# EAGLE design Low Noise Supply (EAGLE 9.6.2)
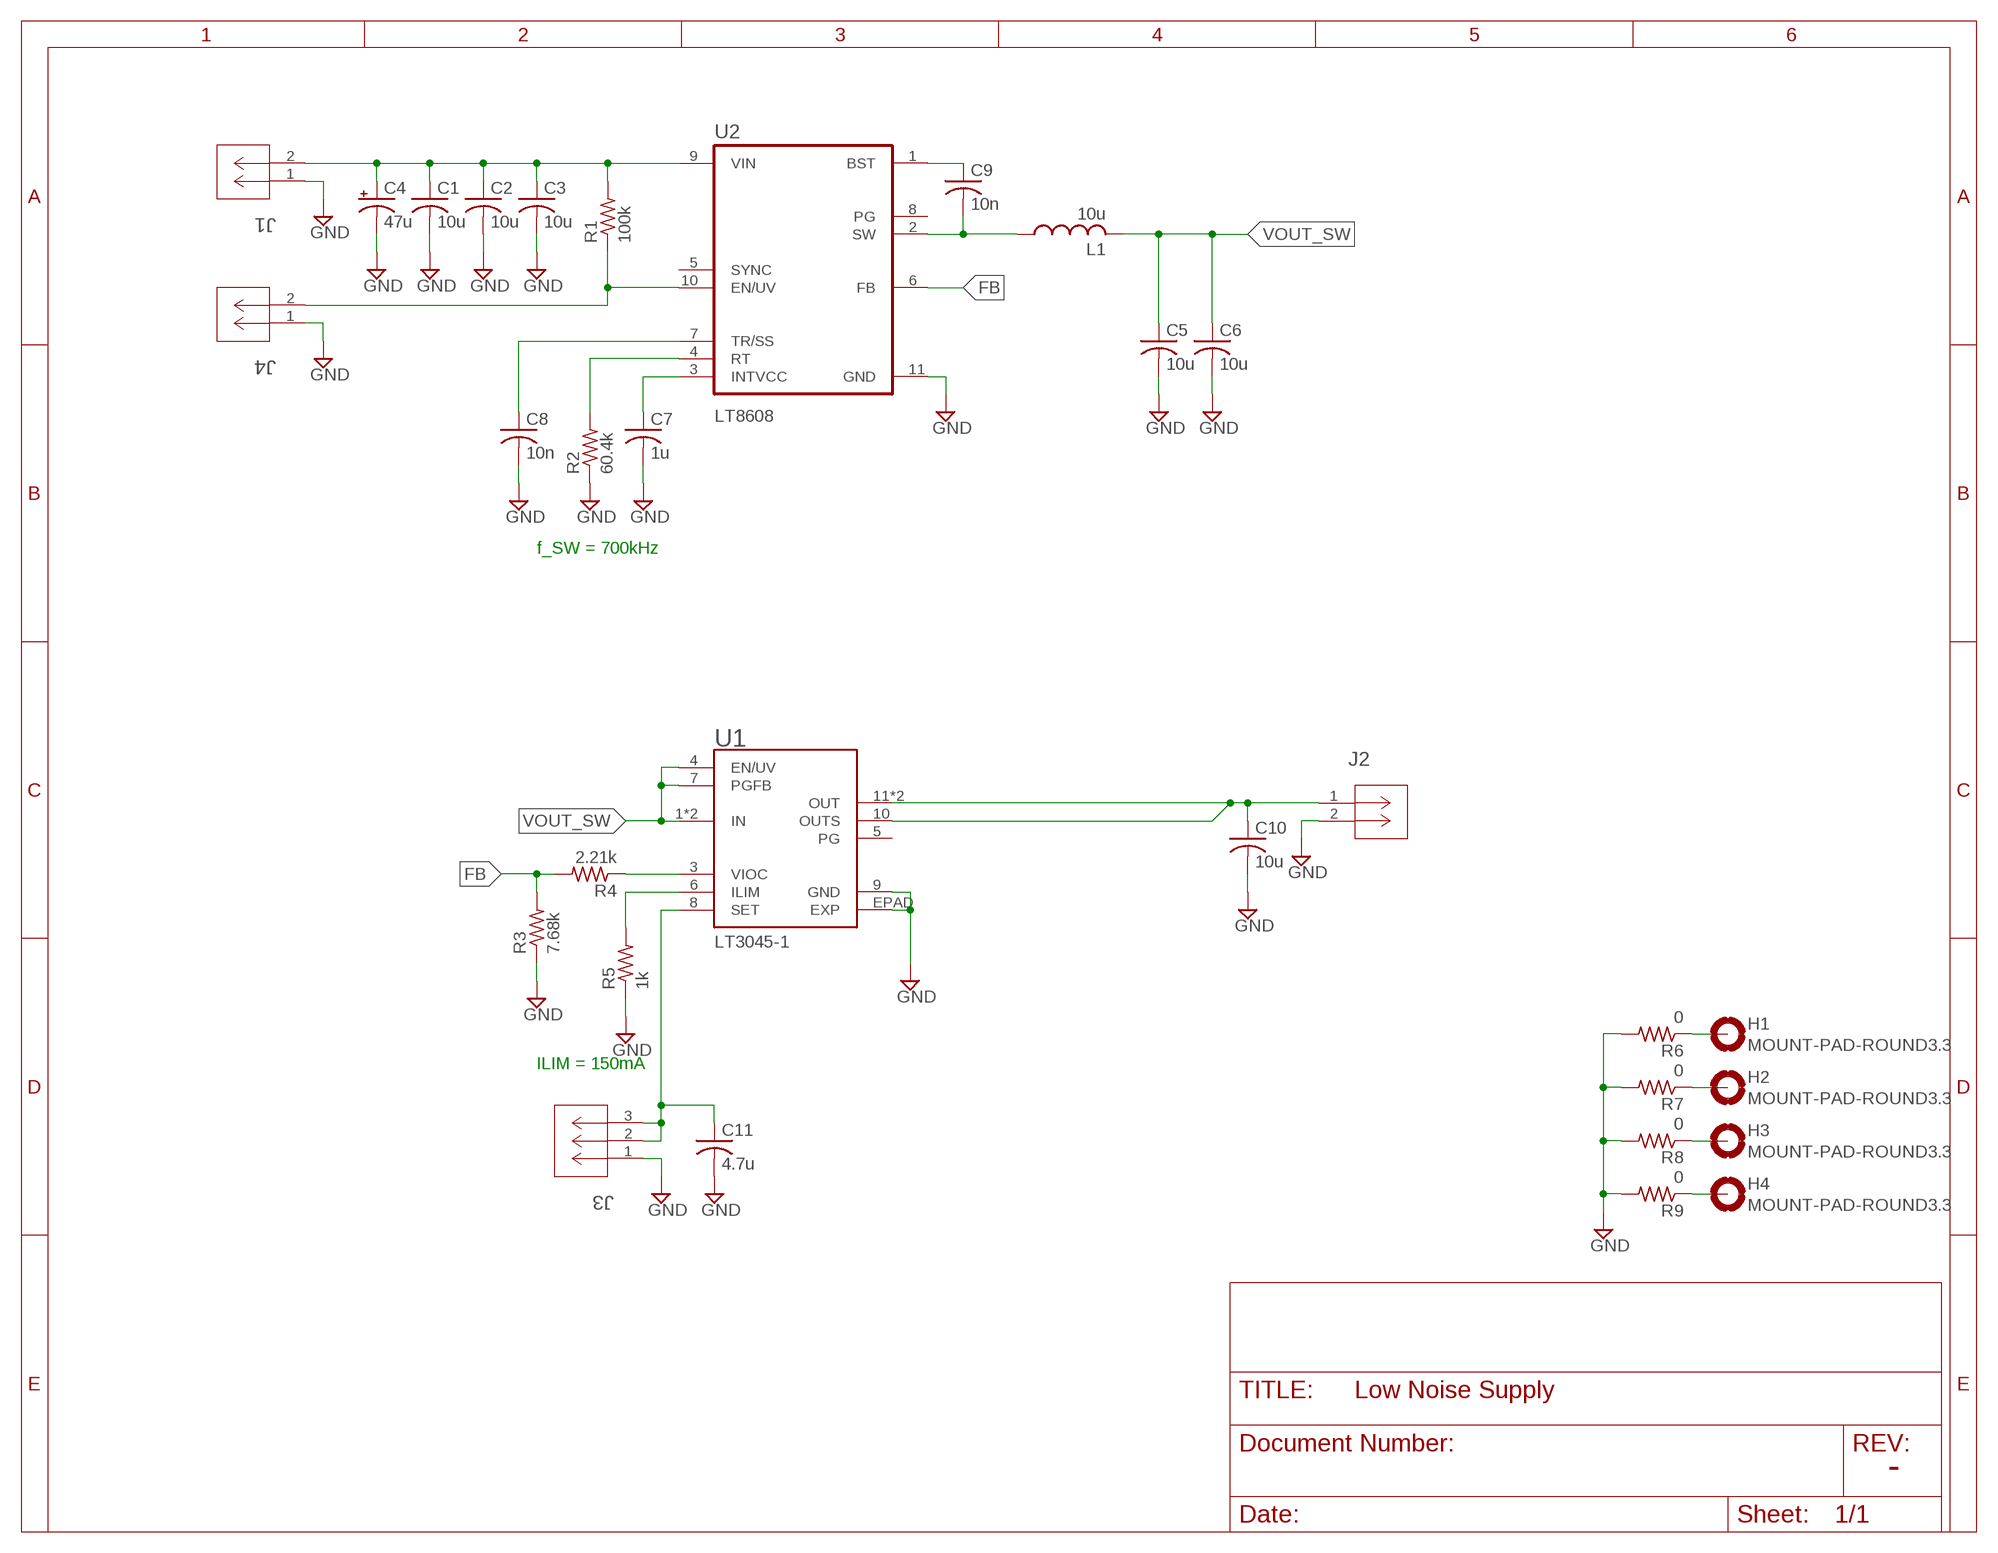
[diagram p0: schematic, sheet 1]

## Parts
C1  10u  C-USC2220K  [C2220K]
C2  10u  C-USC2220K  [C2220K]
C3  10u  C-USC2220K  [C2220K]
C4  47u  CPOL-USF  [PANASONIC_F]
C5  10u  C-USC2220K  [C2220K]
C6  10u  C-USC2220K  [C2220K]
C7  1u  C-USC0805  [C0805]
C8  10n  C-USC0805  [C0805]
C9  10n  C-USC0805  [C0805]
C10  10u  C-USC2220K  [C2220K]
C11  4.7u  C-USC0805  [C0805]
H1  MOUNT-PAD-ROUND3.3  [3,3-PAD]
H2  MOUNT-PAD-ROUND3.3  [3,3-PAD]
H3  MOUNT-PAD-ROUND3.3  [3,3-PAD]
H4  MOUNT-PAD-ROUND3.3  [3,3-PAD]
J1  OSTVN02A150  [CONN_OSTVN02A150_OST]
J2  OSTVN02A150  [CONN_OSTVN02A150_OST]
J3  OSTVN03A150  [CONN3_OSTVN03A150_OST]
J4  OSTVN02A150  [CONN_OSTVN02A150_OST]
L1  10u  L-USL0805  [R0805]
R1  100k  R-US_R0805  [R0805]
R2  60.4k  R-US_R0805  [R0805]
R3  7.68k  R-US_R0805  [R0805]
R4  2.21k  R-US_R0805  [R0805]
R5  1k  R-US_R0805  [R0805]
R6  0  R-US_R0805  [R0805]
R7  0  R-US_R0805  [R0805]
R8  0  R-US_R0805  [R0805]
R9  0  R-US_R0805  [R0805]
U1  LT3045-1  LT3045EMSEPBFMSOP12_MSE_ADI-M  [MSOP12_MSE_ADI-M]
U2  LT8608  LT8608EMSE#PBF  [MSOP-10_MSE]

## Nets
FB: R3.2 R4.2 U2.6(FB)
GND: C1.2 C2.2 C3.2 C4.- C5.2 C6.2 C7.2 C8.2 C10.2 C11.2 J1.1 J2.2 J3.1 J4.1 R2.1 R3.1 R5.1 R6.2 R7.2 R8.2 R9.2 U1.9(GND) U1.EPAD(EXP) U2.11(GND)
N$1: C1.1 C2.1 C3.1 C4.+ J1.2 R1.2 U2.9(VIN)
N$2: J4.2 R1.1 U2.10(EN/UV)
N$3: C7.1 U2.3(INTVCC)
N$4: C8.1 U2.7(TR/SS)
N$5: R2.2 U2.4(RT)
N$6: C9.2 L1.1 U2.2(SW)
N$7: C9.1 U2.1(BST)
N$10: R4.1 U1.3(VIOC)
N$11: C10.1 J2.1 U1.10(OUTS) U1.11(OUT) U1.12(OUT)
N$12: C11.1 J3.2 J3.3 U1.8(SET)
N$13: R5.2 U1.6(ILIM)
N$14: H1.B3,3(MOUNT) R6.1
N$15: H2.B3,3(MOUNT) R7.1
N$16: H3.B3,3(MOUNT) R8.1
N$17: H4.B3,3(MOUNT) R9.1
VOUT_SW: C5.1 C6.1 L1.2 U1.1(IN) U1.2(IN) U1.4(EN/UV) U1.7(PGFB)
Unconnected: U1.5(PG) U2.5(SYNC) U2.8(PG)

## Notes on the sheet
- f_SW = 700kHz
- ILIM = 150mA
- -

## Library data of the parts
C1-C3 C5-C11 = rcl:C-US: CAPACITOR, American symbol
C4 = rcl:CPOL-US: POLARIZED CAPACITOR, American symbol; PN: EEH-ZC1H470P
H1-H4 = holes:MOUNT-PAD-ROUND: MOUNTING PAD, round
J1 J2 J4 = custom_connectors:OSTVN02A150; COPYRIGHT: Copyright (C) 2022 Ultra Librarian. All rights reserved.; DIGI-KEY_PART_NUMBER_1: ED10561-ND; MANUFACTURER_PART_NUMBER: OSTVN02A150; MFR_NAME: On Shore Technology
J3 = custom_connectors:OSTVN03A150; COPYRIGHT: Copyright (C) 2022 Ultra Librarian. All rights reserved.; DIGI-KEY_PART_NUMBER_1: ED10562-ND; MANUFACTURER_PART_NUMBER: OSTVN03A150; MFR_NAME: On Shore Technology
L1 = rcl:L-US: INDUCTOR, American symbol
R1-R9 = rcl:R-US_: RESISTOR, American symbol
U1 = LT3045EDD-1_TRPBF:LT3045EMSEPBF; COPYRIGHT: Copyright (C) 2023 Ultra Librarian. All rights reserved.; DIGI-KEY_PART_NUMBER_1: LT3045EMSE#PBF-ND; MANUFACTURER_PART_NUMBER: LT3045EMSE#PBF; MFR_NAME: Analog Devices Inc
U2 = LT8608EMSE_PBF:LT8608EMSE#PBF: None Check availability <https://pricing.snapeda.com/parts/LT8608EMSE%23PBF/Analog%20Devices/view-part?ref=eda>; AVAILABILITY: In Stock; DESCRIPTION: Buck Switching Regulator IC Positive Adjustable 0.778V 1 Output 1.5A 10-TFSOP, 10-MSOP (0.118, 3.00mm Width) Exposed Pad; MF: Analog Devices; MP: LT8608EMSE#PBF; PACKAGE: MSOP -10 Analog Devices; PRICE: None; PURCHASE-URL: https://pricing.snapeda.com/search/part/LT8608EMSE#PBF/?ref=eda

## Board
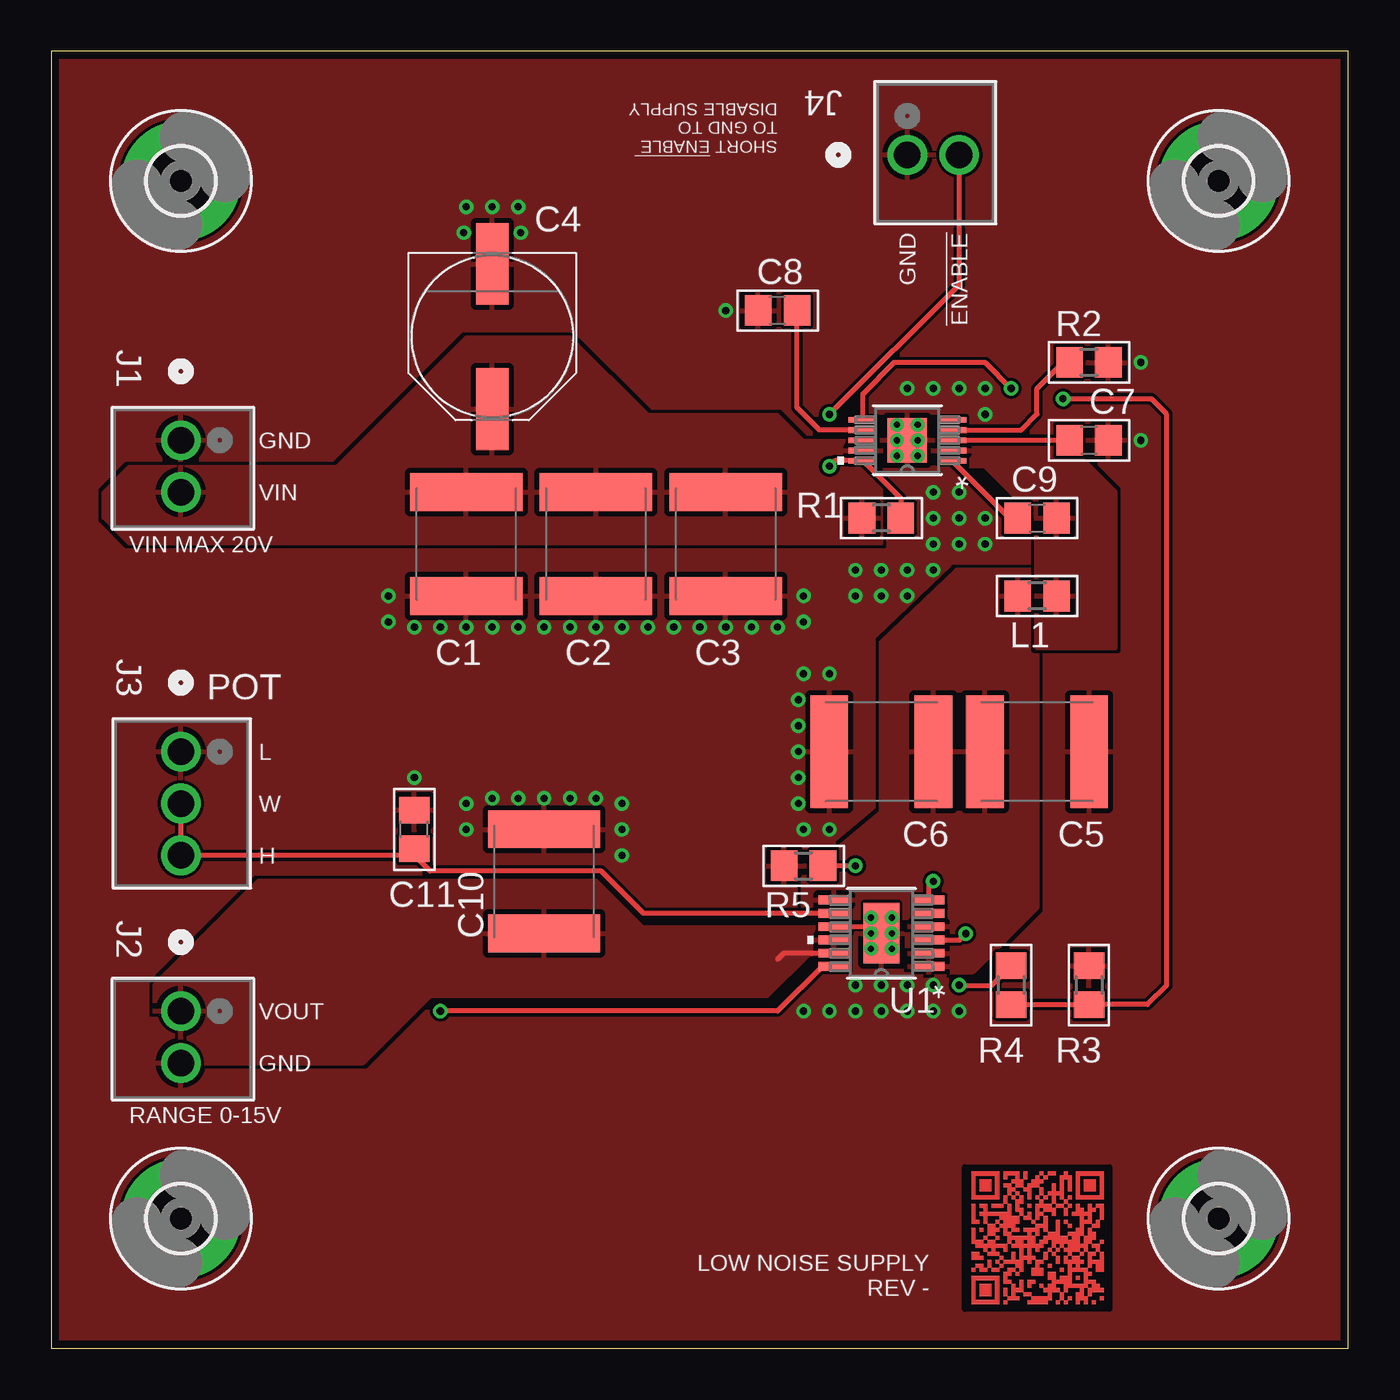
[diagram p1: board, top side]
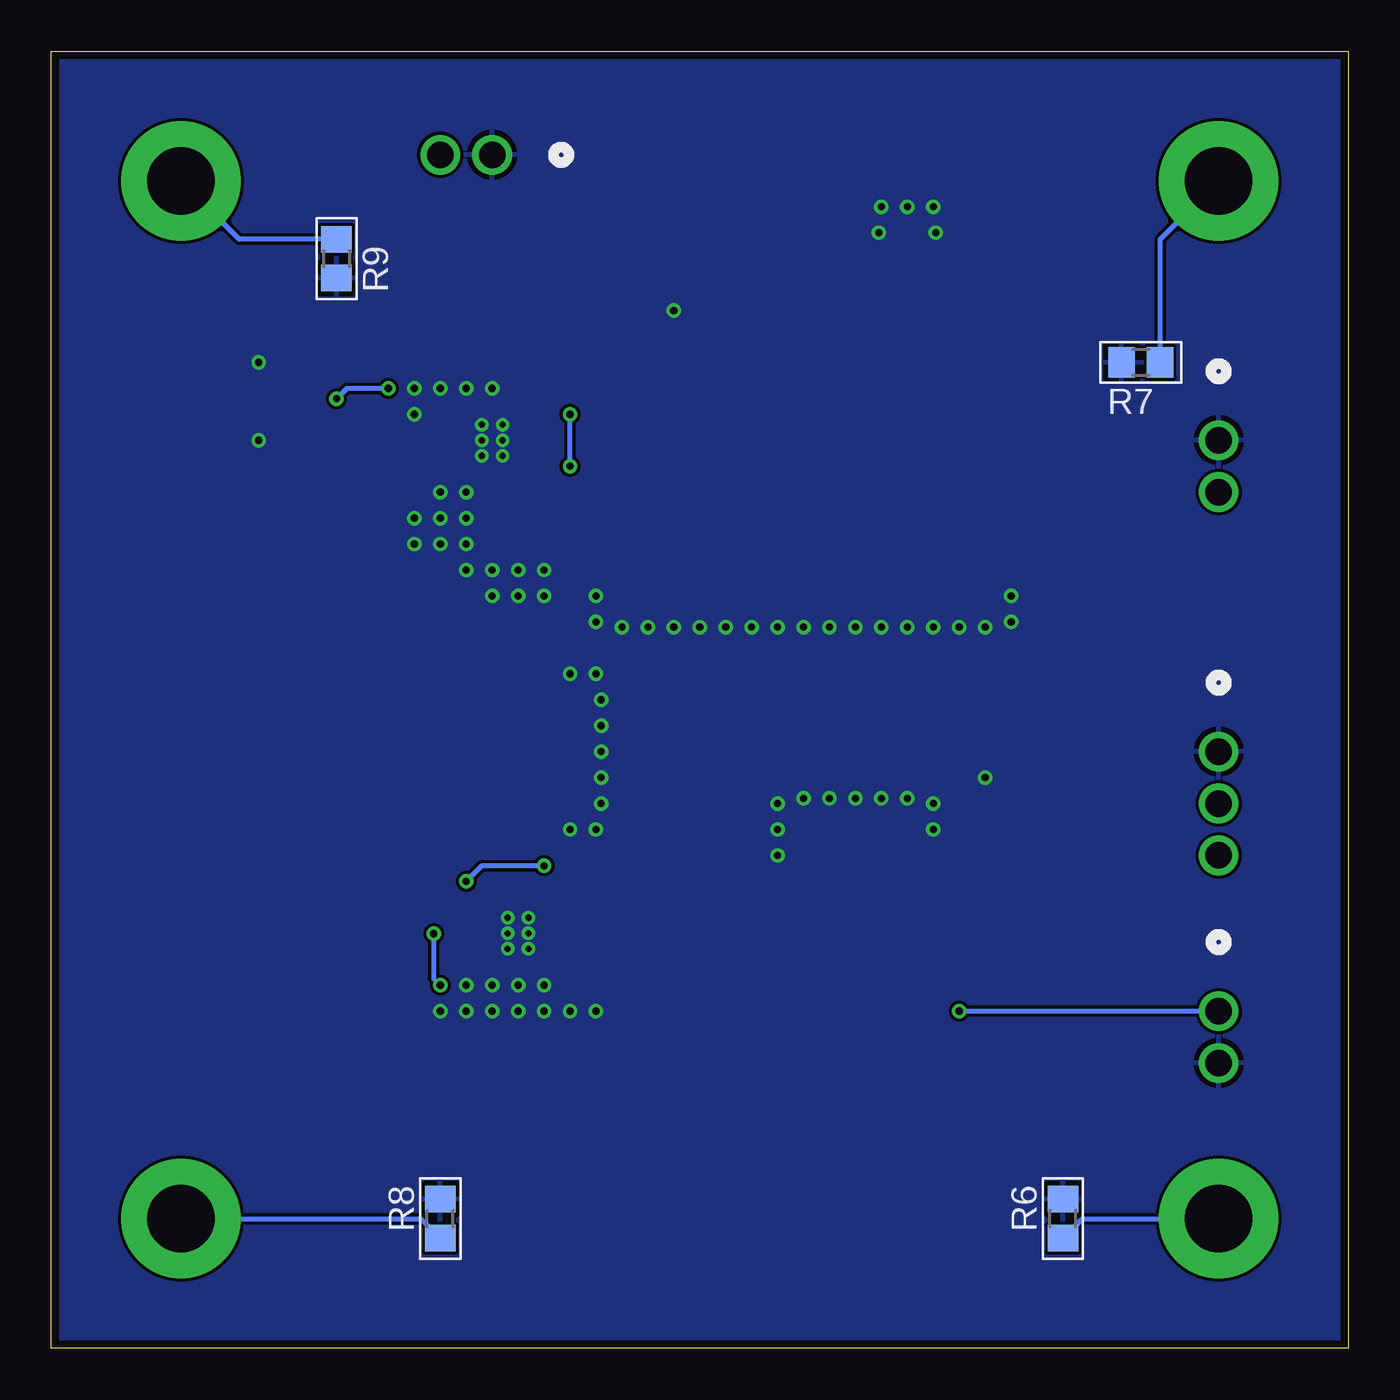
[diagram p2: board, bottom side, seen from below]

Size 63.5 x 63.5 mm. Coordinates in mm from the lower left corner, seen from the top.
Outline: 0,0 63.5,0 63.5,63.5 0,63.5 0,0
Copper layers (1*16): Top 0.0356mm / dielectric 1.5011mm / Bottom 0.0356mm
Design rules "oshpark-2layer *": minimum track width 6mil, minimum drill 10mil, track to track 6mil, track to pad 6mil, pad to pad 6mil, via to via 6mil, smd to smd 6mil, copper to edge 15mil, drill to drill 6mil, minimum pad ring 7mil, minimum via ring 7mil, stop-mask expansion 2.5mil, vias tented up to drill 20mil, thermal gap 10mil
tRestrict: area 44.7,1.9 to 51.8,8.9

### Footprints (pad centres in the part's own frame; a part is rotated, then mirrored left to right if it is on the bottom)
C2220K = smd 1.85 x 5.5: 1 -2.55,0; 2 2.55,0
PANASONIC_F = smd 4 x 1.6: + 3.55,0; - -3.55,0
C0805 = smd 1.3 x 1.5: 1 -0.95,0; 2 0.95,0
3,3-PAD = drill 3.3 pad 5.842: B3,3 0,0
CONN_OSTVN02A150_OST = drill 1.295 pad 1.803: 1 0,0; 2 2.54,0
CONN3_OSTVN03A150_OST = drill 1.295 pad 1.803: 1 0,0; 2 2.54,0; 3 5.08,0
R0805 = smd 1.3 x 1.5: 1 -0.95,0; 2 0.95,0
MSOP12_MSE_ADI-M = smd 1.537 x 0.432: 1 -2.318,1.626; 2 -2.318,0.975; 3 -2.318,0.325; 4 -2.318,-0.325; 5 -2.318,-0.975; 6 -2.318,-1.626; 7 2.318,-1.626; 8 2.318,-0.975; 9 2.318,-0.325; 10 2.318,0.325; 11 2.318,0.975; 12 2.318,1.626 | smd 1.753 x 2.946: EPAD 0,0
MSOP-10_MSE = smd 1.397 x 0.279: 1 -2.184,1.001; 2 -2.184,0.5; 3 -2.184,0; 4 -2.184,-0.5; 5 -2.184,-1.001; 6 2.184,-1.001; 7 2.184,-0.5; 8 2.184,0; 9 2.184,0.5; 10 2.184,1.001 | smd 1.93 x 2.159: 11 0,0

### Placement (x,y rotation side)
C1  20.32,39.37 270 top
C2  26.67,39.37 270 top
C3  33.02,39.37 270 top
C4  21.59,49.53 270 top
C5  48.26,29.21 0 top
C6  40.64,29.21 180 top
C7  50.8,44.45 0 top
C8  35.56,50.8 180 top
C9  48.26,40.64 0 top
C10  24.13,22.86 90 top
C11  17.78,25.4 90 top
H1  6.35,6.35 0 top
H2  6.35,57.15 0 top
H3  57.15,6.35 0 top
H4  57.15,57.15 0 top
J1  6.35,44.45 270 top
J2  6.35,16.51 270 top
J3  6.35,29.21 270 top
J4  41.91,58.42 0 top
L1  48.26,36.83 180 top
R1  40.64,40.64 180 top
R2  50.8,48.26 180 top
R3  50.8,17.78 270 top
R4  46.99,17.78 270 top
R5  36.83,23.62 0 top
R6  13.97,6.35 90 bottom
R7  10.16,48.26 180 bottom
R8  44.45,6.35 90 bottom
R9  49.53,53.34 270 bottom
U1  40.64,20.32 180 top
U2  41.91,44.45 180 top

### Tracks (layer width: path | path; a pad name or v marks a point on that pad's centre or on a via)
FB  (via drill 0.35)
  Top 0.254: U2.6 39.73,46.72 41.27,48.26 45.72,48.26 v46.99,46.99 | v49.53,46.48 53.85,46.48 54.61,45.72 54.61,17.78 53.66,16.83 R3.2 R4.2
  Bottom 0.254: v46.99,46.99 49.02,46.99 v49.53,46.48
GND  (via drill 0.3, 0.35)
  Top 0.254: U1.9 40.31,20.64 U1.EPAD
  other vias: 20.32,35.31 19.05,35.31 21.59,35.31 26.67,35.31 25.4,35.31 27.94,35.31 31.75,35.31 33.02,35.31 34.29,35.31 21.59,55.88 22.86,55.88 22.99,54.61 20.19,54.61 20.32,55.88 33.02,50.8 35.56,35.31 30.48,35.31 29.21,35.31 24.13,35.31 22.86,35.31 17.78,35.31 16.51,35.56 16.51,36.83 36.83,35.56 36.83,36.83 53.34,44.45 53.34,48.26 36.58,26.67 36.58,27.94 36.58,29.21 36.58,30.48 36.58,31.75 36.83,33.02 38.1,33.02 36.83,25.4 38.1,25.4 24.13,26.92 25.4,26.92 26.67,26.92 27.94,26.67 27.94,25.4 22.86,26.92 21.59,26.92 20.32,26.67 20.32,25.4 17.78,27.94 40.13,21.08 41.15,21.08 41.15,20.32 40.13,19.56 41.15,19.56 41.4,45.21 42.42,45.21 41.4,44.45 42.42,44.45 41.4,43.69 42.42,43.69 43.18,41.91 44.45,41.91 43.18,40.64 44.45,40.64 45.72,40.64 45.72,39.37 44.45,39.37 43.18,39.37 41.91,38.1 40.64,38.1 39.37,38.1 43.18,38.1 41.91,36.83 40.64,36.83 39.37,36.83 41.91,46.99 43.18,46.99 44.45,46.99 45.72,46.99 45.72,45.72 39.37,17.78 40.64,17.78 41.91,17.78 43.18,17.78 43.18,16.51 41.91,16.51 40.64,16.51 39.37,16.51 38.1,16.51 36.83,16.51 44.45,16.51 27.94,24.13 40.13,20.32
  pour Bottom: 0,0 0,63.5 63.5,63.5 63.5,0
  pour Top (rank 3): 63.5,0 63.5,63.5 0,63.5 0,0
N$1
  pour Top: 3.81,43.18 13.97,43.18 20.32,49.53 25.4,49.53 29.21,45.72 35.56,45.72 36.83,44.45 40.64,44.45 40.64,39.37 3.81,39.37 2.54,40.64 2.54,41.91
N$2  (via drill 0.35)
  Top 0.254: R1.1 41.59,41.59 U2.10 38.37,43.45 v38.1,43.18 | v38.1,45.72 44.45,52.07 J4.2
  Bottom 0.254: v38.1,43.18 v38.1,45.72
N$3
  Top 0.254: U2.3 C7.1
N$4
  Top 0.254: U2.7 37.6,44.95 36.51,46.04 C8.1
N$5
  Top 0.254: U2.4 47.49,44.95 48.26,45.72 48.26,46.99 49.53,48.26 R2.2
N$6
  pour Top: 43.18,44.45 49.53,44.45 52.07,41.91 52.07,34.29 48.26,34.29 48.26,40.64 45.72,43.18 43.18,43.18
N$7
  Top 0.254: U2.1 46.9,40.64 C9.1
N$10  (via drill 0.35)
  Top 0.254: U1.3 44.47,20 v44.77,20.3 | v44.45,17.78 46.04,17.78 R4.1
  Bottom 0.254: v44.77,20.3 44.77,18.1 v44.45,17.78
N$11  (via drill 0.35)
  Top 0.254: v19.05,16.51 35.56,16.51 37.74,18.69 U1.12 | U1.11 35.85,19.34 35.56,19.05
  Bottom 0.254: v19.05,16.51 J2.1
  pour Top: 5.08,17.78 5.08,15.24 6.35,13.97 15.24,13.97 18.54,17.27 35.05,17.27 37.08,19.3 38.35,19.3 38.35,20.57 28.96,20.57 26.67,22.86 10.16,22.86
N$12
  Top 0.254: C11.1 17.62,24.29 | 17.62,24.29 17.46,24.13 J3.3 J3.2 | 17.62,24.29 18.54,23.37 26.92,23.37 29,21.3 U1.8
N$13  (via drill 0.35)
  Top 0.254: v39.37,23.62 R5.2 | v43.18,22.86 42.96,22.64 U1.6
  Bottom 0.254: v39.37,23.62 42.42,23.62 v43.18,22.86
N$14
  Bottom 0.254: R6.1 13.02,6.35 H1.B3,3
N$15
  Bottom 0.254: R7.1 9.21,54.29 H2.B3,3
N$16
  Bottom 0.254: H3.B3,3 45.4,6.35 R8.1
N$17
  Bottom 0.254: R9.1 54.29,54.29 H4.B3,3
VOUT_SW
  pour Top (rank 2): 48.26,38.1 48.26,21.59 45.09,18.41 42.04,18.41 42.04,21.08 36.83,21.08 36.83,23.07 40.64,26.25 40.64,34.57 44.33,38.1
(copper drawn outside any net)
  shapes: Top area x9164

### Text on the board
tPlace: SHORT !ENABLE / TO GND TO / DISABLE SUPPLY | GND | !ENABLE | GND | VIN | VIN MAX 20V | POT | L | W | H | VOUT | GND | RANGE 0-15V | LOW NOISE SUPPLY / REV -